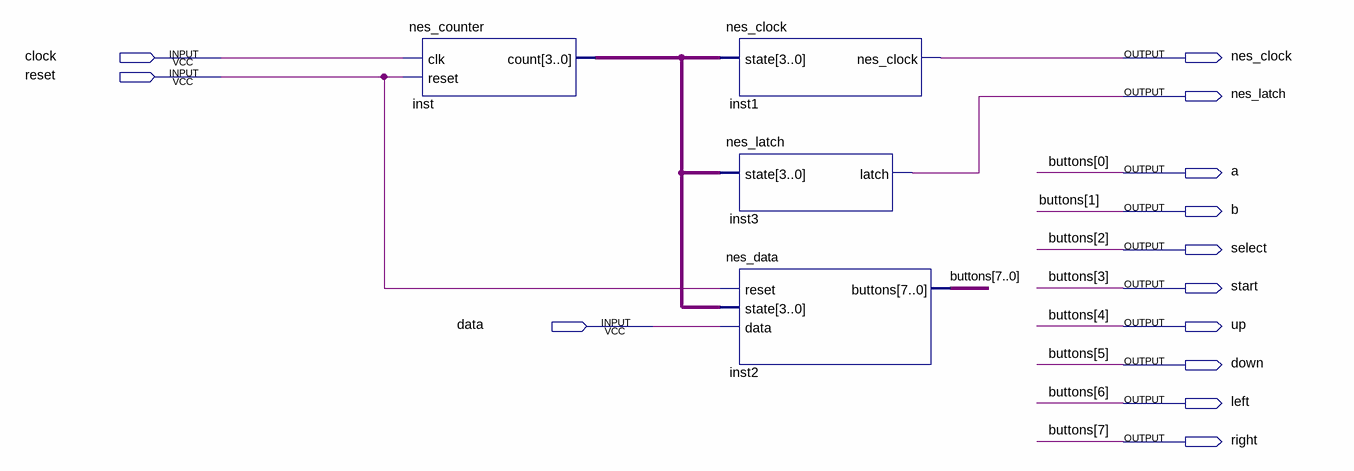
[diagram p0: schematic sheet]
// Quartus schematic nes_decoder.bdf as structural Verilog: 4 symbols, 13 pins
module nes_decoder (
  input  clock,
  input  reset,
  input  data,
  output nes_clock,
  output nes_latch,
  output a,
  output b,
  output select,
  output start,
  output up,
  output down,
  output left,
  output right
);

  wire [3:0] inst_count;

  nes_counter inst (.clk(clock), .reset(reset), .count(inst_count));
  nes_clock inst1 (.state(inst_count), .nes_clock(nes_clock));
  nes_latch inst3 (.state(inst_count), .latch(nes_latch));
  nes_data inst2 (
    .reset(reset), .state(inst_count), .data(data), .buttons({right, left, down, up, start, select, b, a}));

  // Other names for the same wires on the sheet: buttons[7:0] = {right, left, down, up, start, select, b, a}
endmodule
